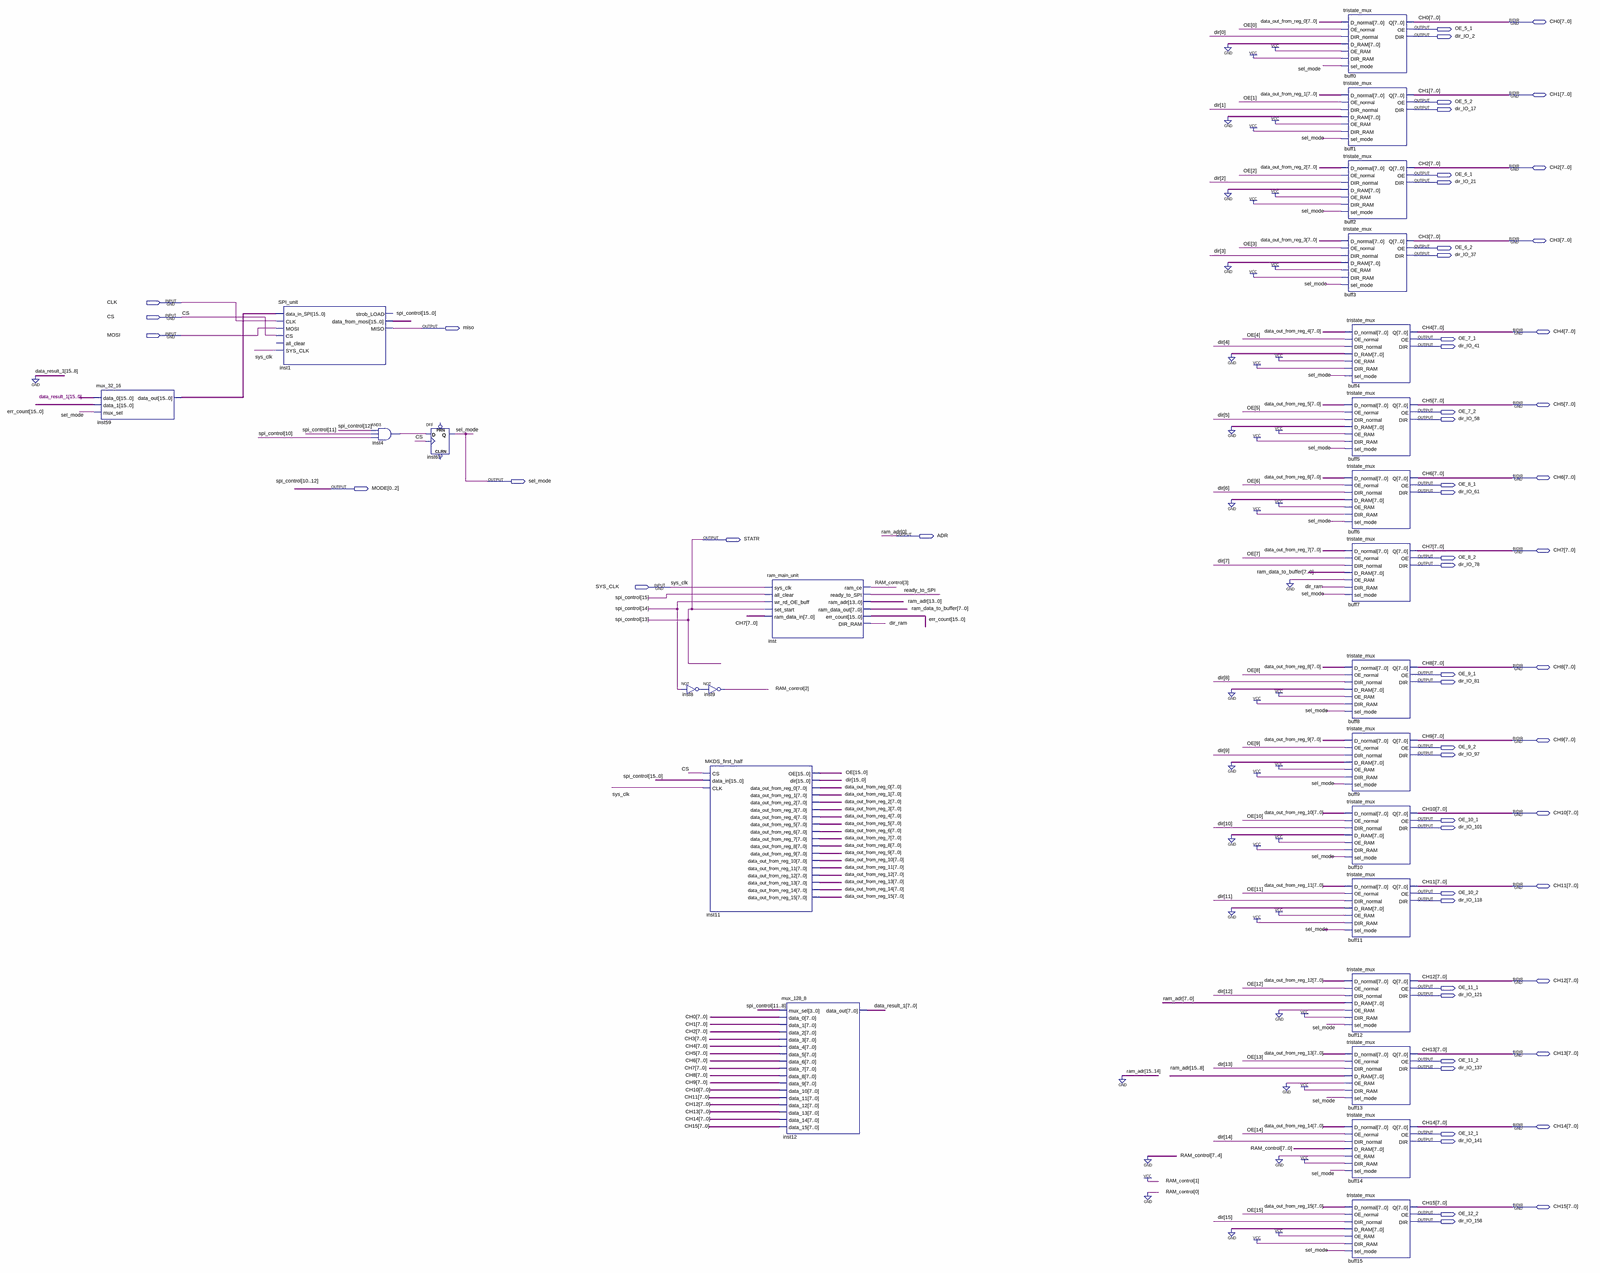
[diagram p0: schematic sheet, whole]
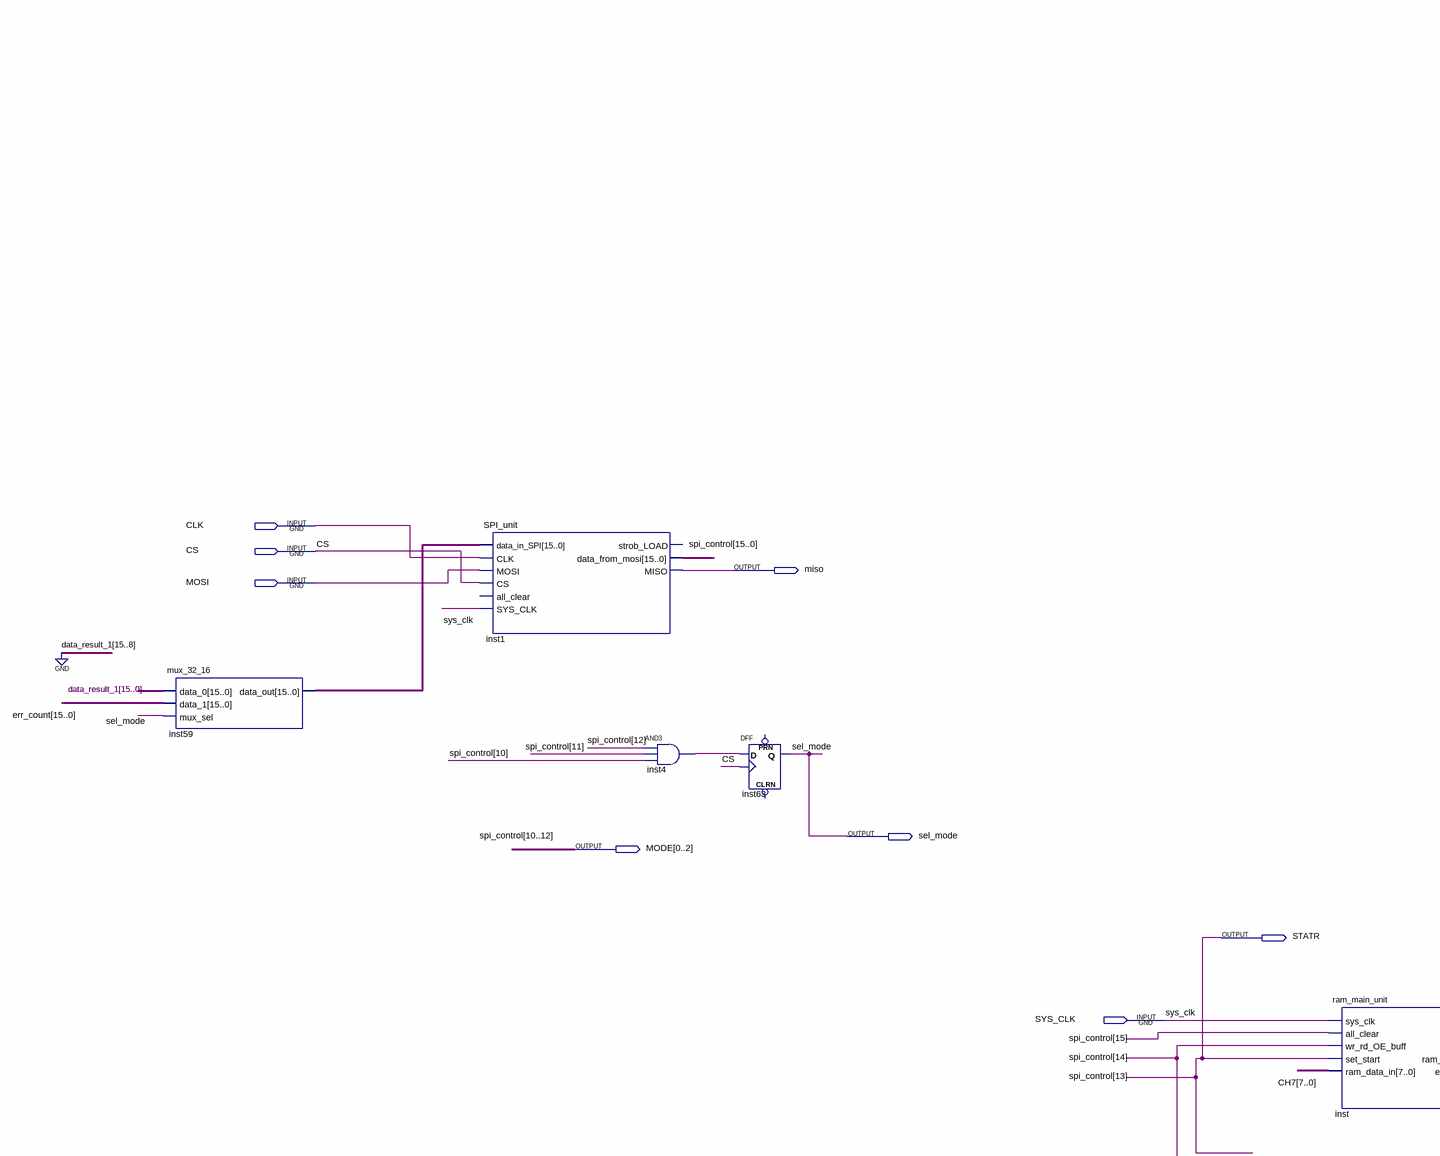
[diagram p1: schematic sheet, upper left part]
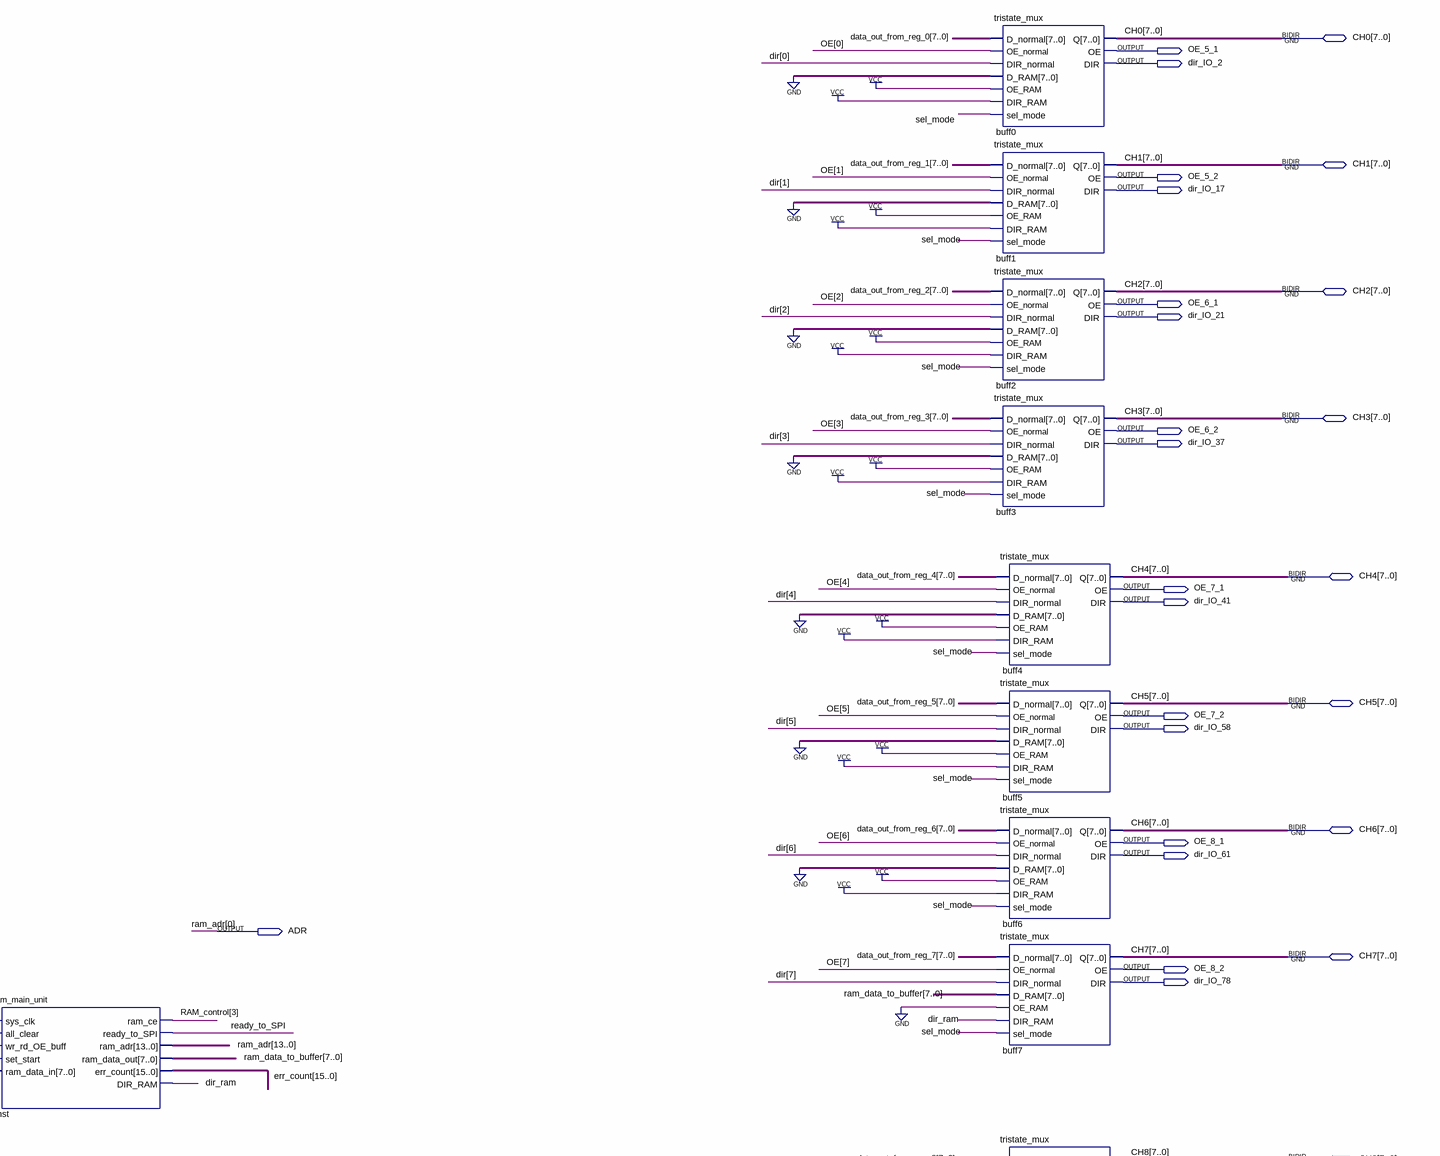
[diagram p2: schematic sheet, upper right part]
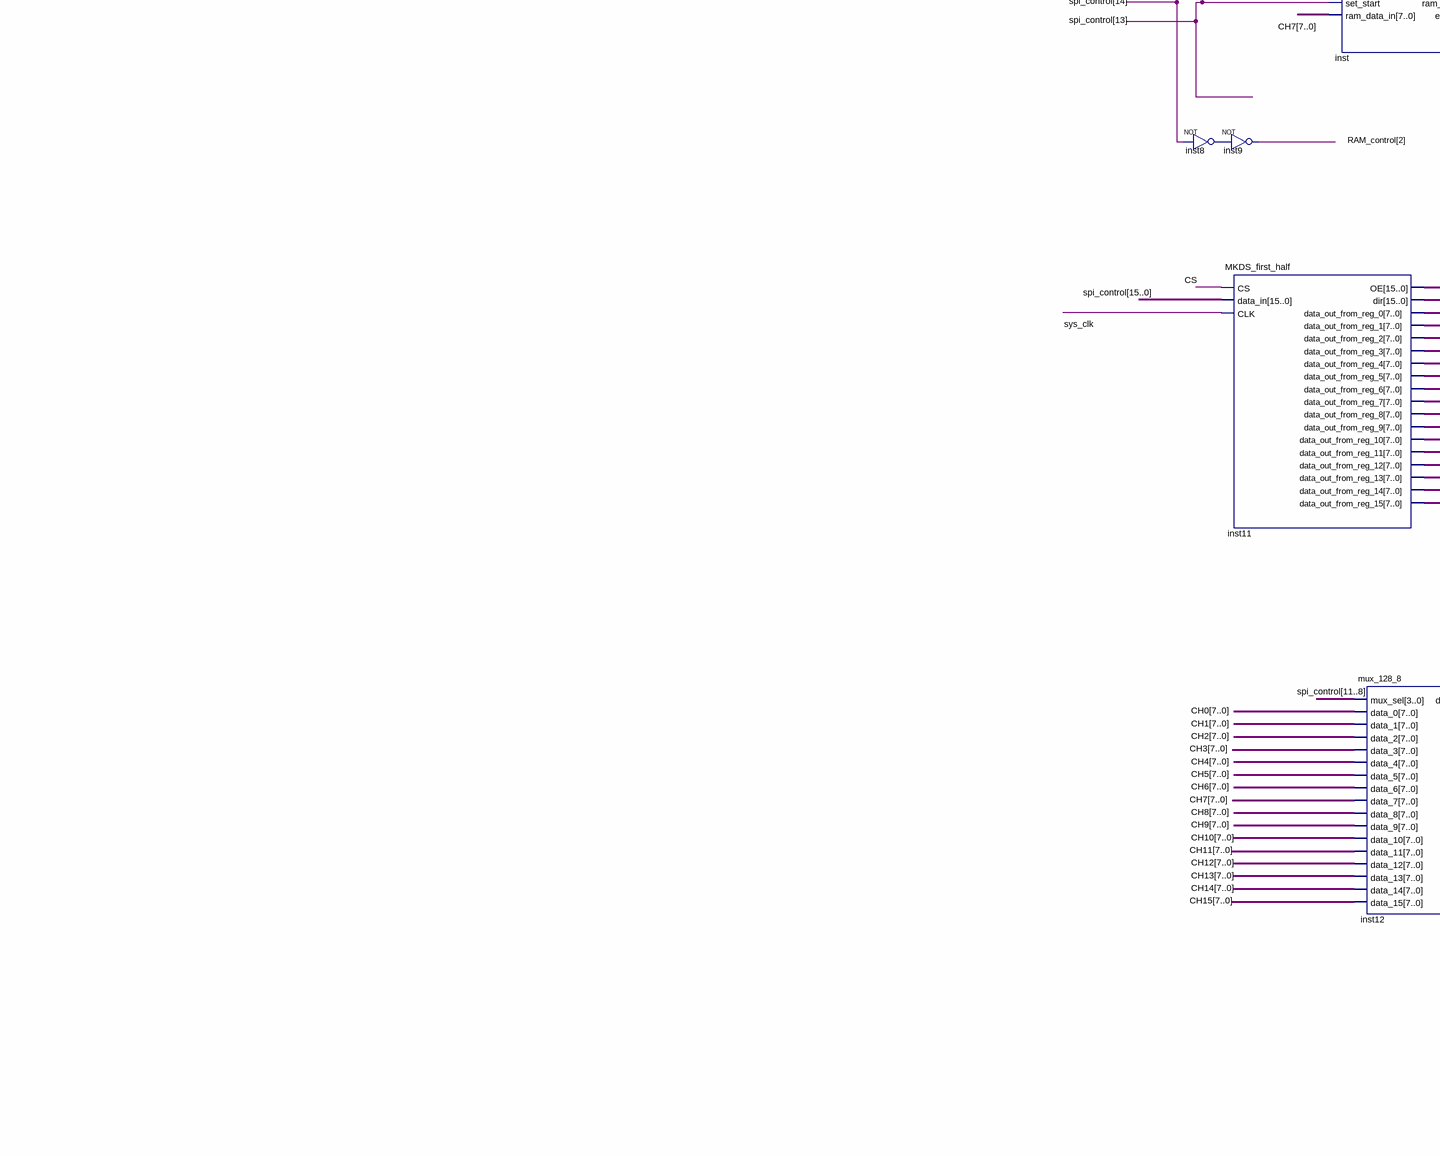
[diagram p3: schematic sheet, lower left part]
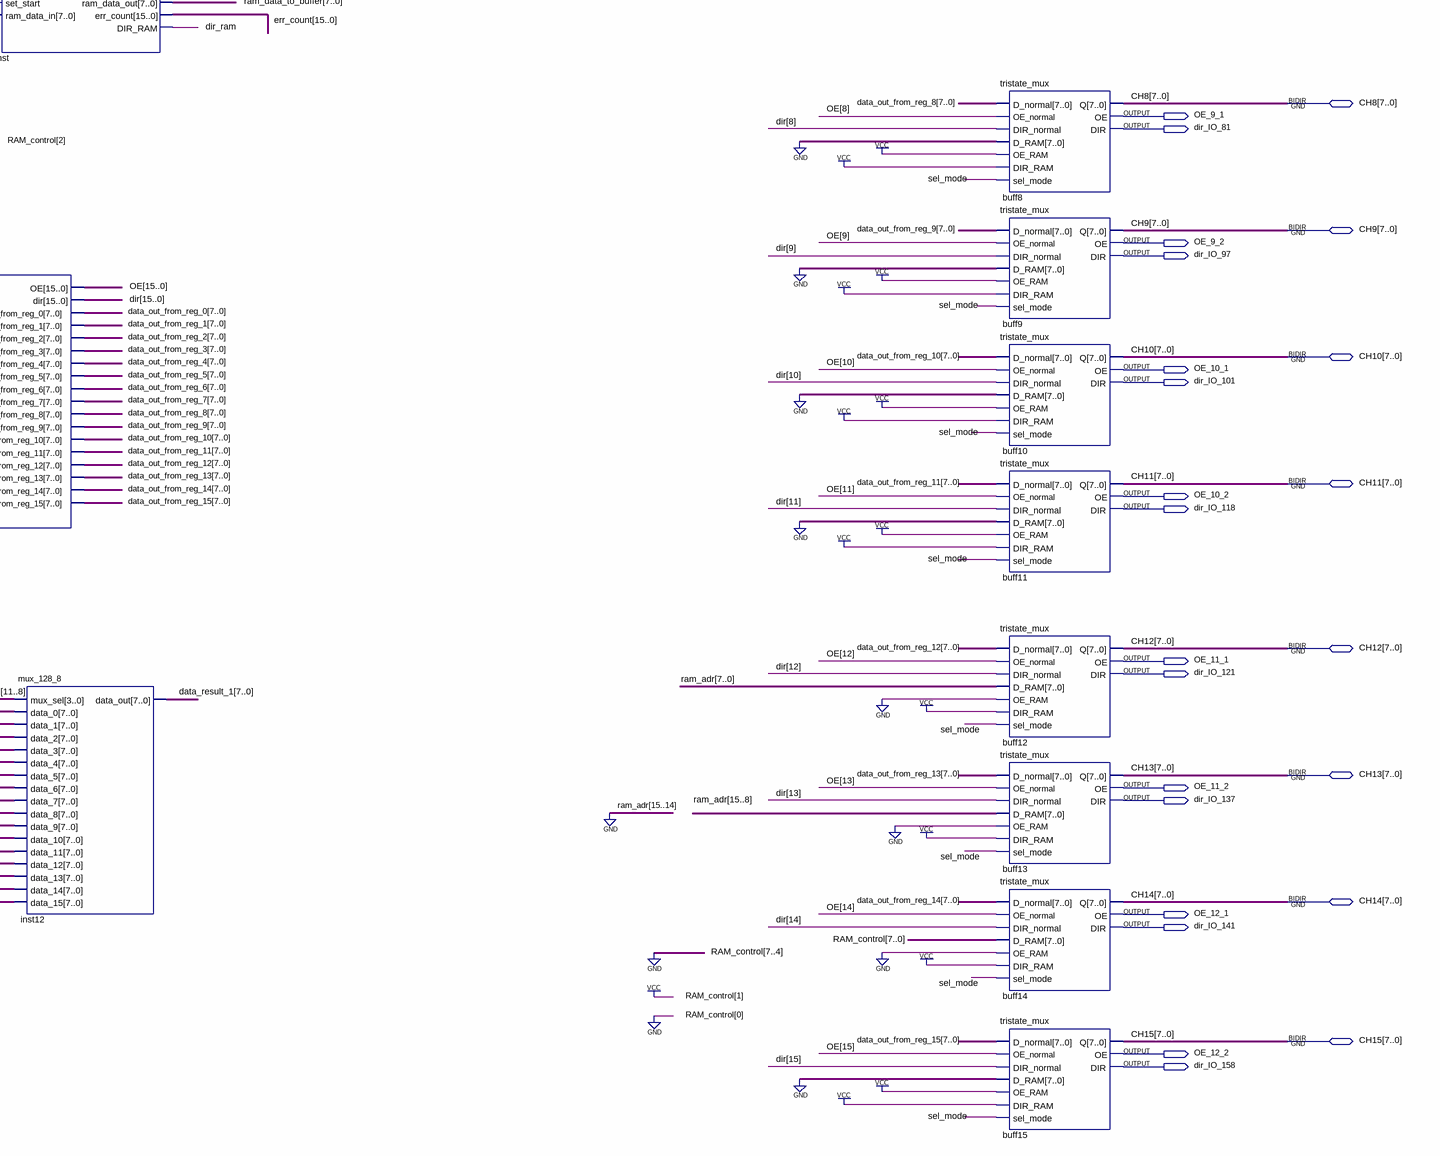
[diagram p4: schematic sheet, lower right part]
// Quartus schematic MKDS_1_0.bdf as structural Verilog: 25 symbols, 57 pins
module MKDS_1_0 (
  input  CLK,
  input  CS,
  input  MOSI,
  input  SYS_CLK,
  inout  [7:0] CH0,
  inout  [7:0] CH1,
  inout  [7:0] CH2,
  inout  [7:0] CH3,
  inout  [7:0] CH4,
  inout  [7:0] CH5,
  inout  [7:0] CH6,
  inout  [7:0] CH7,
  inout  [7:0] CH8,
  inout  [7:0] CH9,
  inout  [7:0] CH10,
  inout  [7:0] CH11,
  inout  [7:0] CH12,
  inout  [7:0] CH13,
  inout  [7:0] CH14,
  inout  [7:0] CH15,
  output OE_5_1,
  output dir_IO_2,
  output OE_5_2,
  output dir_IO_17,
  output OE_6_1,
  output dir_IO_21,
  output OE_6_2,
  output dir_IO_37,
  output miso,
  output OE_7_1,
  output dir_IO_41,
  output OE_7_2,
  output dir_IO_58,
  output sel_mode,
  output OE_8_1,
  output [0:2] MODE,
  output dir_IO_61,
  output ADR,
  output STATR,
  output OE_8_2,
  output dir_IO_78,
  output OE_9_1,
  output dir_IO_81,
  output OE_9_2,
  output dir_IO_97,
  output OE_10_1,
  output dir_IO_101,
  output OE_10_2,
  output dir_IO_118,
  output OE_11_1,
  output dir_IO_121,
  output OE_11_2,
  output dir_IO_137,
  output OE_12_1,
  output dir_IO_141,
  output OE_12_2,
  output dir_IO_158
);

  wire dir_ram, inst4_out, inst8_out, ready_to_SPI;
  wire [3:2] RAM_control;
  wire [7:0] data_out_from_reg_0, data_out_from_reg_1, data_out_from_reg_2, data_out_from_reg_3,
       data_out_from_reg_4, data_out_from_reg_5, data_out_from_reg_6, data_out_from_reg_7,
       data_out_from_reg_8, data_out_from_reg_9, data_out_from_reg_10, data_out_from_reg_11,
       data_out_from_reg_12, data_out_from_reg_13, data_out_from_reg_14, data_out_from_reg_15, data_result_1,
       ram_data_to_buffer;
  wire [13:1] ram_adr;
  wire [15:0] dir, err_count, inst59_data_out, OE, spi_control;

  mux_32_16 inst59 (
    .data_0({{8{1'b0}}, data_result_1}), .data_1(err_count), .mux_sel(sel_mode), .data_out(inst59_data_out));
  SPI_unit inst1 (
    .data_in_SPI(inst59_data_out), .CLK(CLK), .MOSI(MOSI), .CS(CS), .SYS_CLK(SYS_CLK),
    .data_from_mosi({spi_control[15:14], STATR, MODE[2], MODE[1], MODE[0], spi_control[9:0]}), .MISO(miso));  // open: all_clear, strob_LOAD
  and inst4 (inst4_out, MODE[2], MODE[1], MODE[0]);
  DFF inst63 (.CLK(CS), .D(inst4_out), .Q(sel_mode));  // open: CLRN, PRN
  not inst8 (inst8_out, spi_control[14]);
  not inst9 (RAM_control[2], inst8_out);
  MKDS_first_half inst11 (
    .CS(CS), .data_in({spi_control[15:14], STATR, MODE[2], MODE[1], MODE[0], spi_control[9:0]}),
    .CLK(SYS_CLK), .OE(OE), .dir(dir), .data_out_from_reg_0(data_out_from_reg_0),
    .data_out_from_reg_1(data_out_from_reg_1), .data_out_from_reg_2(data_out_from_reg_2),
    .data_out_from_reg_3(data_out_from_reg_3), .data_out_from_reg_4(data_out_from_reg_4),
    .data_out_from_reg_5(data_out_from_reg_5), .data_out_from_reg_6(data_out_from_reg_6),
    .data_out_from_reg_7(data_out_from_reg_7), .data_out_from_reg_8(data_out_from_reg_8),
    .data_out_from_reg_9(data_out_from_reg_9), .data_out_from_reg_10(data_out_from_reg_10),
    .data_out_from_reg_11(data_out_from_reg_11), .data_out_from_reg_12(data_out_from_reg_12),
    .data_out_from_reg_13(data_out_from_reg_13), .data_out_from_reg_14(data_out_from_reg_14),
    .data_out_from_reg_15(data_out_from_reg_15));
  ram_main_unit inst (
    .sys_clk(SYS_CLK), .all_clear(spi_control[15]), .wr_rd_OE_buff(spi_control[14]), .set_start(STATR),
    .ram_data_in(CH7), .ram_ce(RAM_control[3]), .ready_to_SPI(ready_to_SPI), .ram_adr({ram_adr, ADR}),
    .ram_data_out(ram_data_to_buffer), .err_count(err_count), .DIR_RAM(dir_ram));
  mux_128_8 inst12 (
    .mux_sel({MODE[1], MODE[0], spi_control[9:8]}), .data_0(CH0), .data_1(CH1), .data_2(CH2), .data_3(CH3),
    .data_4(CH4), .data_5(CH5), .data_6(CH6), .data_7(CH7), .data_8(CH8), .data_9(CH9), .data_10(CH10),
    .data_11(CH11), .data_12(CH12), .data_13(CH13), .data_14(CH14), .data_15(CH15), .data_out(data_result_1));
  tristate_mux buff0 (
    .D_normal(data_out_from_reg_0), .OE_normal(OE[0]), .DIR_normal(dir[0]), .D_RAM({8{1'b0}}), .OE_RAM(1'b1),
    .DIR_RAM(1'b1), .sel_mode(sel_mode), .Q(CH0), .OE(OE_5_1), .DIR(dir_IO_2));
  tristate_mux buff1 (
    .D_normal(data_out_from_reg_1), .OE_normal(OE[1]), .DIR_normal(dir[1]), .D_RAM({8{1'b0}}), .OE_RAM(1'b1),
    .DIR_RAM(1'b1), .sel_mode(sel_mode), .Q(CH1), .OE(OE_5_2), .DIR(dir_IO_17));
  tristate_mux buff2 (
    .D_normal(data_out_from_reg_2), .OE_normal(OE[2]), .DIR_normal(dir[2]), .D_RAM({8{1'b0}}), .OE_RAM(1'b1),
    .DIR_RAM(1'b1), .sel_mode(sel_mode), .Q(CH2), .OE(OE_6_1), .DIR(dir_IO_21));
  tristate_mux buff3 (
    .D_normal(data_out_from_reg_3), .OE_normal(OE[3]), .DIR_normal(dir[3]), .D_RAM({8{1'b0}}), .OE_RAM(1'b1),
    .DIR_RAM(1'b1), .sel_mode(sel_mode), .Q(CH3), .OE(OE_6_2), .DIR(dir_IO_37));
  tristate_mux buff4 (
    .D_normal(data_out_from_reg_4), .OE_normal(OE[4]), .DIR_normal(dir[4]), .D_RAM({8{1'b0}}), .OE_RAM(1'b1),
    .DIR_RAM(1'b1), .sel_mode(sel_mode), .Q(CH4), .OE(OE_7_1), .DIR(dir_IO_41));
  tristate_mux buff5 (
    .D_normal(data_out_from_reg_5), .OE_normal(OE[5]), .DIR_normal(dir[5]), .D_RAM({8{1'b0}}), .OE_RAM(1'b1),
    .DIR_RAM(1'b1), .sel_mode(sel_mode), .Q(CH5), .OE(OE_7_2), .DIR(dir_IO_58));
  tristate_mux buff6 (
    .D_normal(data_out_from_reg_6), .OE_normal(OE[6]), .DIR_normal(dir[6]), .D_RAM({8{1'b0}}), .OE_RAM(1'b1),
    .DIR_RAM(1'b1), .sel_mode(sel_mode), .Q(CH6), .OE(OE_8_1), .DIR(dir_IO_61));
  tristate_mux buff7 (
    .D_normal(data_out_from_reg_7), .OE_normal(OE[7]), .DIR_normal(dir[7]), .D_RAM(ram_data_to_buffer),
    .OE_RAM(1'b0), .DIR_RAM(dir_ram), .sel_mode(sel_mode), .Q(CH7), .OE(OE_8_2), .DIR(dir_IO_78));
  tristate_mux buff8 (
    .D_normal(data_out_from_reg_8), .OE_normal(OE[8]), .DIR_normal(dir[8]), .D_RAM({8{1'b0}}), .OE_RAM(1'b1),
    .DIR_RAM(1'b1), .sel_mode(sel_mode), .Q(CH8), .OE(OE_9_1), .DIR(dir_IO_81));
  tristate_mux buff9 (
    .D_normal(data_out_from_reg_9), .OE_normal(OE[9]), .DIR_normal(dir[9]), .D_RAM({8{1'b0}}), .OE_RAM(1'b1),
    .DIR_RAM(1'b1), .sel_mode(sel_mode), .Q(CH9), .OE(OE_9_2), .DIR(dir_IO_97));
  tristate_mux buff10 (
    .D_normal(data_out_from_reg_10), .OE_normal(OE[10]), .DIR_normal(dir[10]), .D_RAM({8{1'b0}}),
    .OE_RAM(1'b1), .DIR_RAM(1'b1), .sel_mode(sel_mode), .Q(CH10), .OE(OE_10_1), .DIR(dir_IO_101));
  tristate_mux buff11 (
    .D_normal(data_out_from_reg_11), .OE_normal(OE[11]), .DIR_normal(dir[11]), .D_RAM({8{1'b0}}),
    .OE_RAM(1'b1), .DIR_RAM(1'b1), .sel_mode(sel_mode), .Q(CH11), .OE(OE_10_2), .DIR(dir_IO_118));
  tristate_mux buff12 (
    .D_normal(data_out_from_reg_12), .OE_normal(OE[12]), .DIR_normal(dir[12]), .D_RAM({ram_adr[7:1], ADR}),
    .OE_RAM(1'b0), .DIR_RAM(1'b1), .sel_mode(sel_mode), .Q(CH12), .OE(OE_11_1), .DIR(dir_IO_121));
  tristate_mux buff13 (
    .D_normal(data_out_from_reg_13), .OE_normal(OE[13]), .DIR_normal(dir[13]),
    .D_RAM({2'b00, ram_adr[13:8]}), .OE_RAM(1'b0), .DIR_RAM(1'b1), .sel_mode(sel_mode), .Q(CH13),
    .OE(OE_11_2), .DIR(dir_IO_137));
  tristate_mux buff14 (
    .D_normal(data_out_from_reg_14), .OE_normal(OE[14]), .DIR_normal(dir[14]),
    .D_RAM({4'b0000, RAM_control, 2'b10}), .OE_RAM(1'b0), .DIR_RAM(1'b1), .sel_mode(sel_mode), .Q(CH14),
    .OE(OE_12_1), .DIR(dir_IO_141));
  tristate_mux buff15 (
    .D_normal(data_out_from_reg_15), .OE_normal(OE[15]), .DIR_normal(dir[15]), .D_RAM({8{1'b0}}),
    .OE_RAM(1'b1), .DIR_RAM(1'b1), .sel_mode(sel_mode), .Q(CH15), .OE(OE_12_2), .DIR(dir_IO_158));

  // Other names for the same wires on the sheet: ram_adr[0] = ADR;
  //   spi_control[13:10] = {STATR, MODE[2], MODE[1], MODE[0]}

  // Notes on the sheet:
  //   data_result_1[15..0]
endmodule
